# EasyEDA schematic 1-Schematic_optical-sensor.json
TITLE: Sheet_1; REV: 1.0; Date: 2024-08-22; Sheet: 1/1; Drawn By: vibhusiddha; Company: Your Company
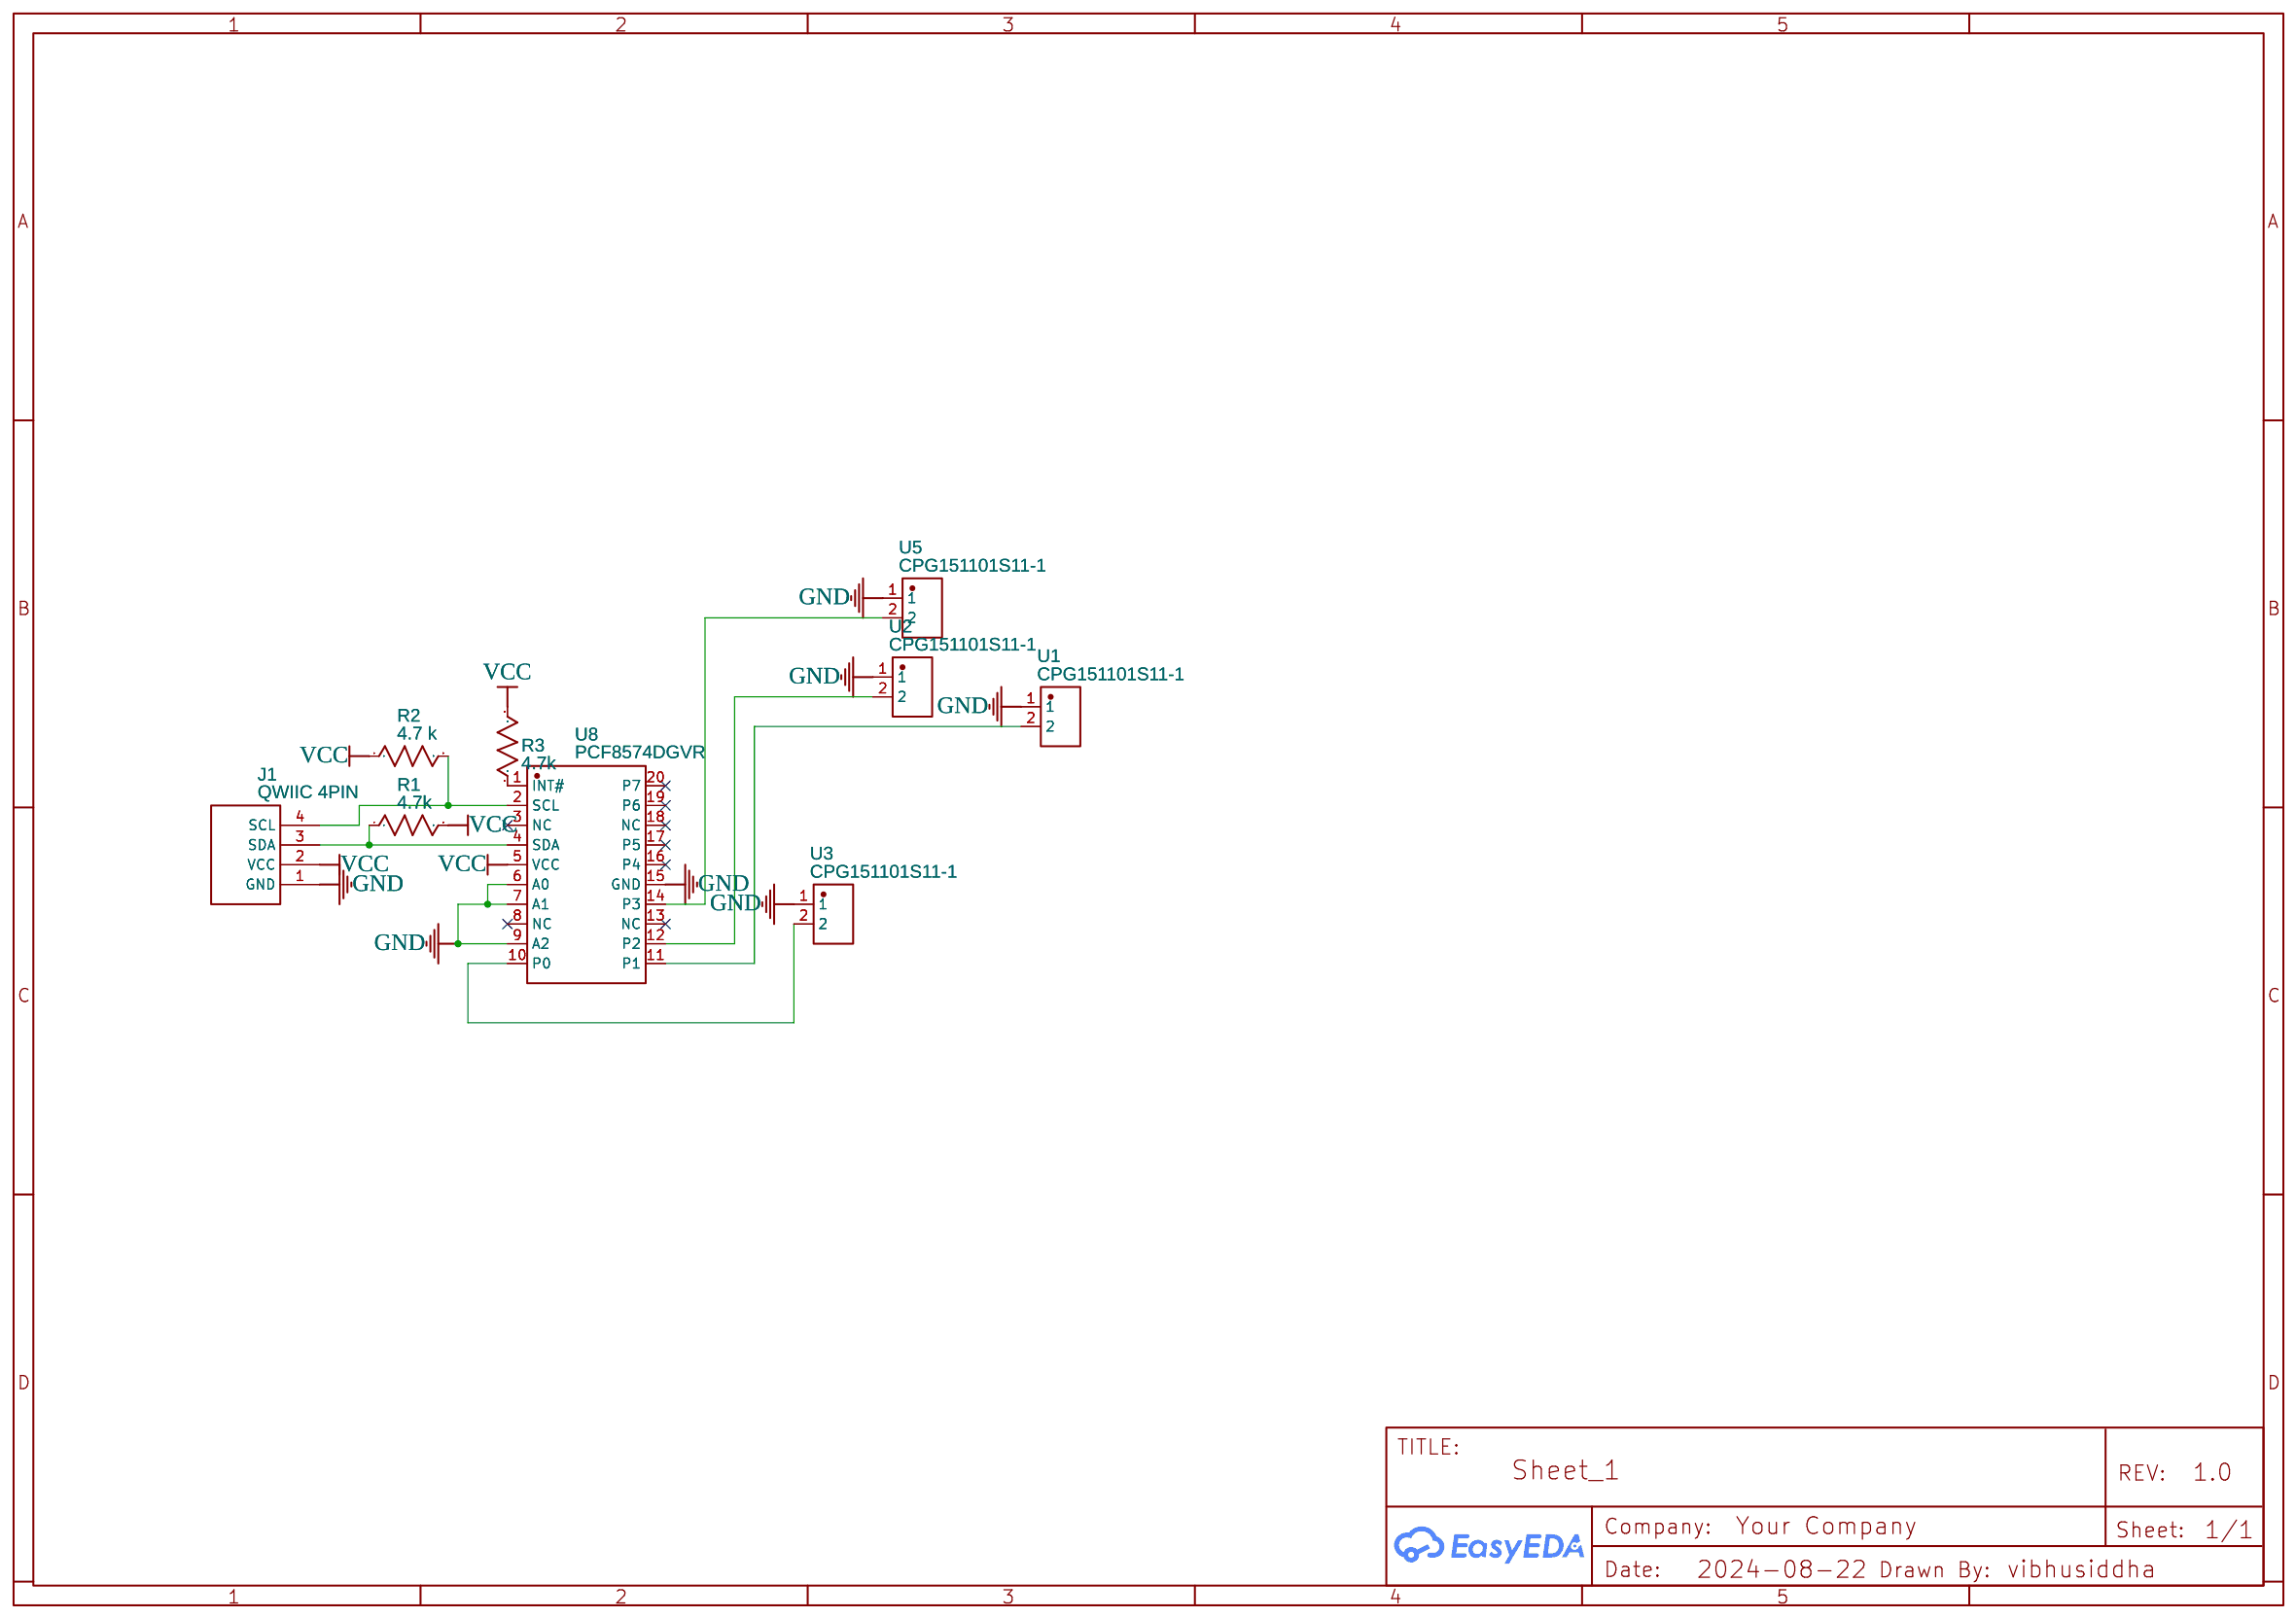
[diagram p0: schematic sheet]

## Parts
J1  QWIIC 4PIN  [QWIIC 4PIN]
R1  4.7k  [R0603]
R2  4.7 k  [R0603]
R3  4.7k  [R0603]
U1  CPG151101S11-1  [TH_L10.9-W5.9-CPG151101S11]
U2  CPG151101S11-1  [TH_L10.9-W5.9-CPG151101S11]
U3  CPG151101S11-1  [TH_L10.9-W5.9-CPG151101S11]
U5  CPG151101S11-1  [TH_L10.9-W5.9-CPG151101S11]
U8  PCF8574DGVR  [TVSOP-20_L5.0-W4.4-P0.40-LS6.4-BL]

## Library data of the parts
J1 = QWIIC 4PIN: Manufacturer: SparkFun Electronics; Manufacturer Part: PRT-14417; Supplier Part: PRT-14417-ND; Supplier: Digi-Key; Contributor: RichardM; Link: https://www.digikey.ca/en/products/detail/sparkfun-electronics/PRT-14417/7652746?s=N4IgTCBcDaIAoCUAqBaAjAFg2g7CAugL5A
R1-R3 = R_0603_US: Contributor: LCEDA_Lib
U1-U3 U5 = CPG151101S11-1: Supplier: LCSC; Supplier Part: C5184526; Manufacturer: Kailh(凯华); JLCPCB Part Class: Extended Part; Contributor: lcsc
U8 = PCF8574DGVR: Contributor: LCSC; Supplier: LCSC; Supplier Part: C2652334; Manufacturer: TI(德州仪器); JLCPCB Part Class: Extended Part

## Nets
GND: J1.1(GND) U1.1 U2.1 U3.1 U5.1 U8.6(A0) U8.7(A1) U8.9(A2) U8.15(GND)
VCC: J1.2(VCC) R1.2 R2.1 R3.2 U8.5(VCC)
Net-(J1-3): J1.3(SDA) R1.1 U8.4(SDA)
Net-(J1-4): J1.4(SCL) R2.2 U8.2(SCL)
Net-(R3-1): R3.1 U8.1(INT#)
Net-(U1-2): U1.2 U8.11(P1)
Net-(U2-2): U2.2 U8.12(P2)
Net-(U3-2): U3.2 U8.10(P0)
Net-(U5-2): U5.2 U8.14(P3)

Not connected (* = marked no-connect by the designer): U8 3(NC)* 8(NC)* 13(NC)* 16(P4)* 17(P5)* 18(NC)* 19(P6)* 20(P7)*
